# EAGLE design MAX31856 (EAGLE 9.5.2)
COMPANY: ADAFRUIT INDUSTRIES; DRAWN: KTOWN; REV: A
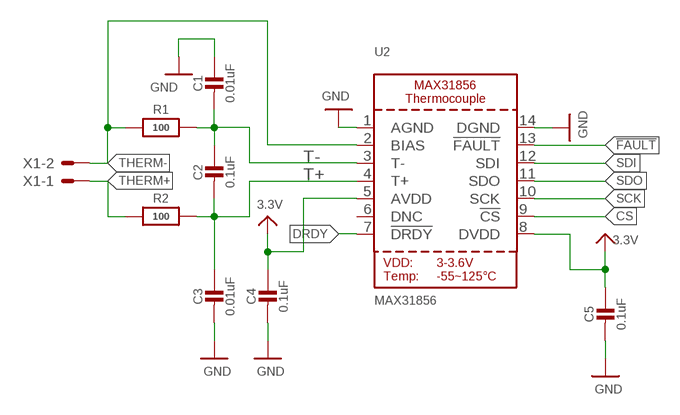
[diagram p0: schematic, sheet 1]

## Parts
C1  0.01uF  CAP_CERAMIC0805_10MGAP  [0805_10MGAP]
C2  0.1uF  CAP_CERAMIC0805-NOOUTLINE  [0805-NO]
C3  0.01uF  CAP_CERAMIC0805-NOOUTLINE  [0805-NO]
C4  0.1uF  CAP_CERAMIC0805-NOOUTLINE  [0805-NO]
C5  0.1uF  CAP_CERAMIC0805-NOOUTLINE  [0805-NO]
R1  100  RESISTOR0805_NOOUTLINE  [0805-NO]
R2  100  RESISTOR0805_NOOUTLINE  [0805-NO]
U2  MAX31856  [TSSOP14]
X1  JST-XH-02-PIN-ROUND-PAD  [JST-XH-02-PACKAGE-ROUND-PAD]

## Nets
3.3V: C4.1 C5.1 U2.5(AVDD) U2.8(DVDD)
!FAULT: U2.13(!FAULT)
CS: U2.9(!CS)
DRDY: U2.7(!DRDY)
GND: C1.1 C3.2 C4.2 C5.2 U2.1(AGND) U2.14(DGND)
SCK: U2.10(SCK)
SDI: U2.12(SDI)
SDO: U2.11(SDO)
T+: C2.2 C3.1 R2.2 U2.4(T+)
T-: C1.2 C2.1 R1.2 U2.3(T-)
THERM+: R2.1 X1.1
THERM-: R1.1 U2.2(BIAS) X1.2
Unconnected: U2.6(DNC)

## Library data of the parts
C1-C5 = microbuilder:CAP_CERAMIC: Ceramic Capacitors For new designs, use the packages preceded by an '_' character since they are more reliable: The following footprints should be used on most boards: _0402 - Standard footprint for regular board layouts _0603 - Standard footprint for regular board layouts _0805 - Standard footprint for regular board layouts _1206 - Standard footprint for regular board layouts For extremely tight-pitch boards where space is at a premium, the following 'micro-pitch' footprints can be used (smaller pads, no silkscreen outline, etc.): _0402MP - Micro-pitch footprint for very dense/compact boards _0603MP - Micro-pitch footprint for very dense/compact boards _0805MP - Micro-pitch footprint for very dense/compact boards _1206MP - Micro-pitch footprint for very dense/compact boards
R1 R2 = microbuilder:RESISTOR: Resistors For new designs, use the packages preceded by an '_' character since they are more reliable: The following footprints should be used on most boards: _0402 - Standard footprint for regular board layouts _0603 - Standard footprint for regular board layouts _0805 - Standard footprint for regular board layouts _1206 - Standard footprint for regular board layouts For extremely tight-pitch boards where space is at a premium, the following 'micro-pitch' footprints can be used (smaller pads, no silkscreen outline, etc.): _0402MP - Micro-pitch footprint for very dense/compact boards _0603MP - Micro-pitch footprint for very dense/compact boards _0805MP - Micro-pitch footprint for very dense/compact boards _1206MP - Micro-pitch footprint for very dense/compact boards
U2 = microbuilder:MAX31856: MAX31856 - Thermocouple Sensor ADC
X1 = JST-XH-Zenith:JST-XH-02-PIN: JST XH Connector 2 Pin Wire to board connector. Pitch: 2,54 mm, (0.100") Number of pins: 2 Created by Rembrandt Electronics www.rembrandtelectronics.com

## Board
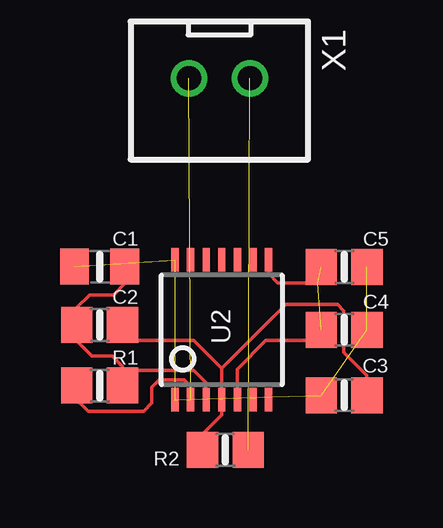
[diagram p1: board, top side]

No outline drawn. Coordinates in mm, seen from the top.
Copper layers (1*16): Top 0.035mm / dielectric 1.5mm / Bottom 0.035mm
Design rules "default": minimum track width 6mil, minimum drill 0.35mm, track to track 6mil, track to pad 6mil, pad to pad 6mil, via to via 6mil, smd to smd 6mil, copper to edge 40mil, drill to drill 6mil, minimum pad ring 10mil, minimum via ring 8mil, stop-mask expansion 4mil, vias tented up to drill 0mil, thermal gap 10mil

### Footprints (pad centres in the part's own frame; a part is rotated, then mirrored left to right if it is on the bottom)
0805_10MGAP = smd 1.2 x 1.5: 1 -1.05,0; 2 1.05,0
0805-NO = smd 1.3 x 1.5: 1 -0.95,0; 2 0.95,0
TSSOP14 = smd 0.305 x 0.991: 1 -1.95,-2.918; 2 -1.3,-2.918; 3 -0.65,-2.918; 4 0,-2.918; 5 0.65,-2.918; 6 1.3,-2.918; 7 1.95,-2.918; 8 1.95,2.918; 9 1.3,2.918; 10 0.65,2.918; 11 0,2.918; 12 -0.65,2.918; 13 -1.3,2.918; 14 -1.95,2.918
JST-XH-02-PACKAGE-ROUND-PAD = drill 1.016: 1 -1.27,0; 2 1.27,0

### Placement (x,y rotation side)
C1  5.07,15.33 0 top
C2  5.07,12.9 0 top
C3  15.26,9.97 180 top
C4  15.26,12.7 0 top
C5  15.26,15.32 0 top
R1  5.07,10.37 0 top
R2  10.31,7.69 180 top
U2  10.16,12.7 0 top
X1  10.06,23.19 180 top

### Tracks (layer width: path | path; a pad name or v marks a point on that pad's centre or on a via)
3.3V  (2 unrouted)
  Top 0.152: C4.1 14.31,12.3 14.26,12.25 12,12.25 10.8,11.05 10.8,9.79 U2.5 | U2.8 12.11,15.04 12.5,14.65 14.15,14.65
GND  (5 unrouted)
T+
  Top 0.152: C2.2 6.67,12.25 9,12.25 10.16,11.09 | 10.16,11.09 U2.4 10.16,9.16 9.36,8.36 R2.2 | C3.1 16.21,10.79 15.25,11.75 15.25,13.48 14.98,13.75 12.82,13.75 10.16,11.09
T-
  Top 0.152: U2.3 9.5,9.79 9.5,10.5 9,11 6.65,11 R1.2 6.02,11.18 5.6,11.6 4.75,11.6 4.12,12.23 C2.1 4.12,13.62 4.65,14.15 5.65,14.15 6.12,14.62 C1.2
THERM+  (1 unrouted)
THERM-  (1 unrouted)
  Top 0.152: R1.1 4.12,9.77 4.59,9.3 6.9,9.3 7.25,9.65 7.25,10.3 7.55,10.6 8.6,10.6 8.86,10.34 U2.2